# Altium schematic sheet Split_action2026.SchDoc
size A4; SheetNumber: 1; SheetTotal: 1
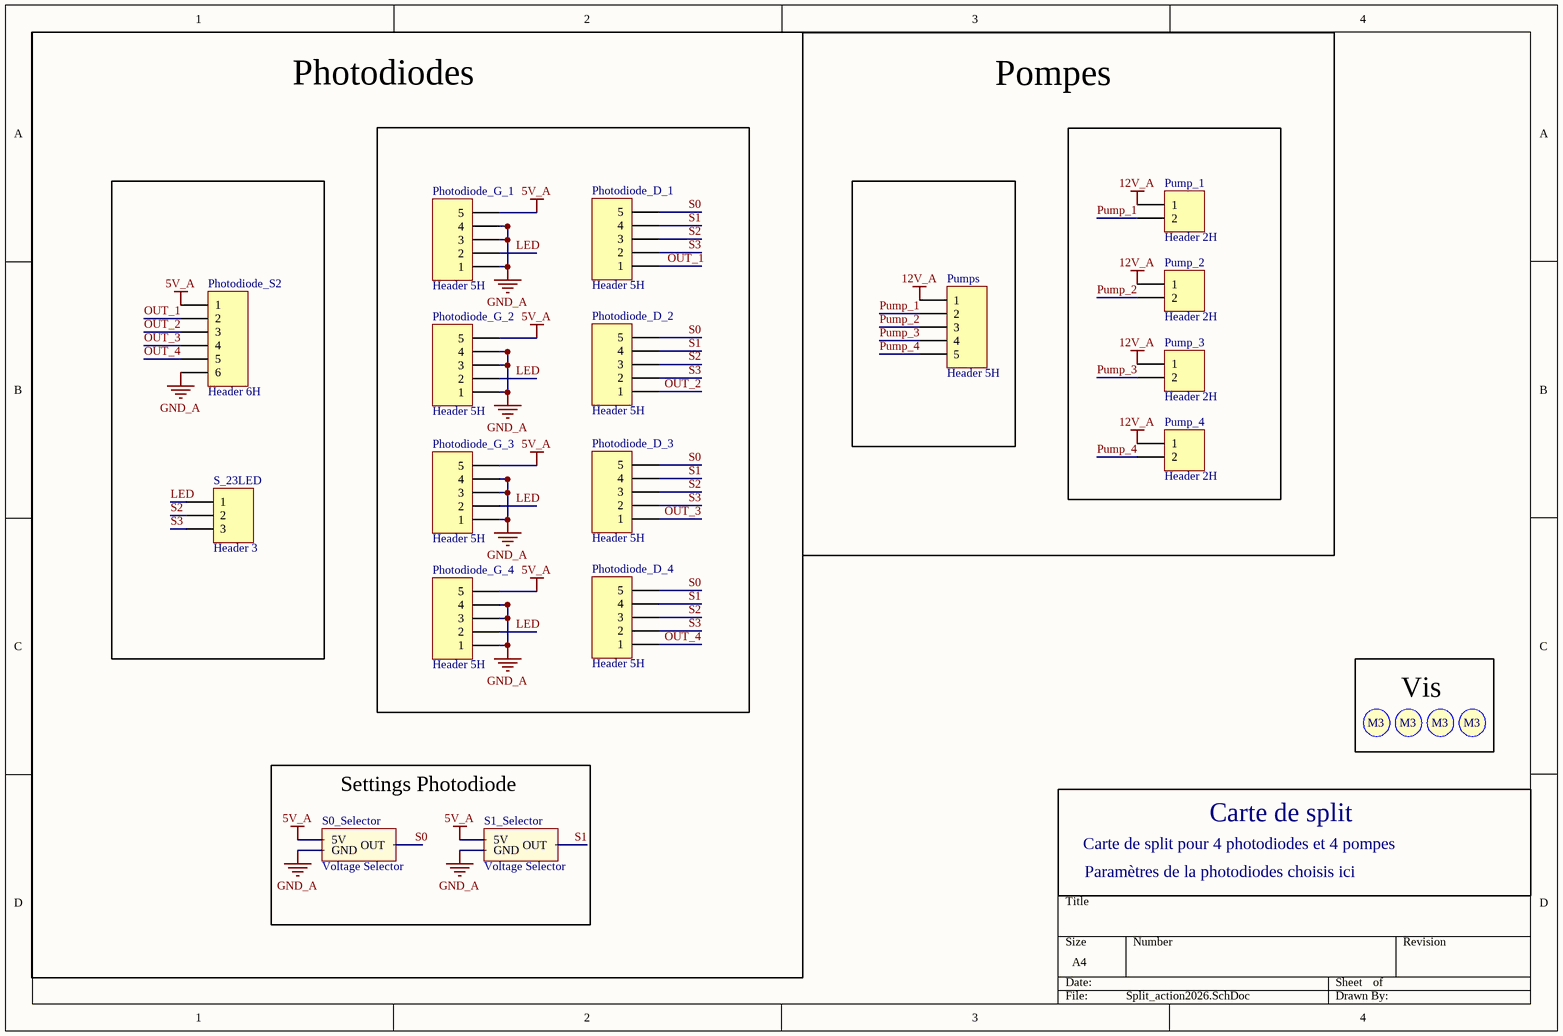
[diagram p0: Split_action2026.SchDoc]

## Parts
Photodiode_D_1  Header 5H  [B5BXHAMLFSN]
Photodiode_D_2  Header 5H  [B5BXHAMLFSN]
Photodiode_D_3  Header 5H  [B5BXHAMLFSN]
Photodiode_D_4  Header 5H  [B5BXHAMLFSN]
Photodiode_G_1  Header 5H  [B5BXHAMLFSN]
Photodiode_G_2  Header 5H  [B5BXHAMLFSN]
Photodiode_G_3  Header 5H  [B5BXHAMLFSN]
Photodiode_G_4  Header 5H  [B5BXHAMLFSN]
Photodiode_S2  Header 6H  [SHDR6W64P0X250_1X6_1740X575X700P]
Pump_1  Header 2H  [JST_B2B-XH-A_(LF)(SN)]
Pump_2  Header 2H  [JST_B2B-XH-A_(LF)(SN)]
Pump_3  Header 2H  [JST_B2B-XH-A_(LF)(SN)]
Pump_4  Header 2H  [JST_B2B-XH-A_(LF)(SN)]
Pumps  Header 5H  [B5BXHAMLFSN]
S0_Selector  Voltage Selector  [VOLTAGE SELECTOR]
S1  Screw M3  [Screw M3]  (value not drawn)
S1_Selector  Voltage Selector  [VOLTAGE SELECTOR]
S2  Screw M3  [Screw M3]  (value not drawn)
S3  Screw M3  [Screw M3]  (value not drawn)
S4  Screw M3  [Screw M3]  (value not drawn)
S_23LED  Header 3  [JST_B3B-XH-A(LF)(SN)]

## Nets
5V_A: Photodiode_G_1.5 Photodiode_G_2.5 Photodiode_G_3.5 Photodiode_G_4.5 Photodiode_S2.1 S0_Selector.1(5V) S1_Selector.1(5V)
12V_A: Pump_1.1 Pump_2.1 Pump_3.1 Pump_4.1 Pumps.1
GND_A: Photodiode_G_1.1 Photodiode_G_1.3 Photodiode_G_1.4 Photodiode_G_2.1 Photodiode_G_2.3 Photodiode_G_2.4 Photodiode_G_3.1 Photodiode_G_3.3 Photodiode_G_3.4 Photodiode_G_4.1 Photodiode_G_4.3 Photodiode_G_4.4 Photodiode_S2.6 S0_Selector.2(GND) S1_Selector.2(GND)
LED: Photodiode_G_1.2 Photodiode_G_2.2 Photodiode_G_3.2 Photodiode_G_4.2 S_23LED.1
OUT_1: Photodiode_D_1.1 Photodiode_S2.2
OUT_2: Photodiode_D_2.1 Photodiode_S2.3
OUT_3: Photodiode_D_3.1 Photodiode_S2.4
OUT_4: Photodiode_D_4.1 Photodiode_S2.5
Pump_1: Pump_1.2 Pumps.2
Pump_2: Pump_2.2 Pumps.3
Pump_3: Pump_3.2 Pumps.4
Pump_4: Pump_4.2 Pumps.5
S0: Photodiode_D_1.5 Photodiode_D_2.5 Photodiode_D_3.5 Photodiode_D_4.5 S0_Selector.3(OUT)
S1: Photodiode_D_1.4 Photodiode_D_2.4 Photodiode_D_3.4 Photodiode_D_4.4 S1_Selector.3(OUT)
S2: Photodiode_D_1.3 Photodiode_D_2.3 Photodiode_D_3.3 Photodiode_D_4.3 S_23LED.2
S3: Photodiode_D_1.2 Photodiode_D_2.2 Photodiode_D_3.2 Photodiode_D_4.2 S_23LED.3

## Notes on the sheet
- Photodiodes
- Pompes
- Extérieur
- (near Pump_1) Extérieur
- Carte Action
- Vis
- Settings Photodiode
- Carte de split pour 4 photodiodes et 4 pompes
- Carte de split
- Paramètres de la photodiodes choisis ici
- (in symbol Screw M3) M3

## Library data of the parts
Photodiode_D_1-Photodiode_D_4 Photodiode_G_1-Photodiode_G_4 Pumps = Header 5H: Header, 5-Pin, Right Angle; LatestRevisionDate: 17-Jul-2002; LatestRevisionNote: Re-released for DXP Platform.; Publisher: Altium Limited
Photodiode_S2 = Header 6H: Header, 6-Pin, Right Angle; LatestRevisionDate: 17-Jul-2002; LatestRevisionNote: Re-released for DXP Platform.; Publisher: Altium Limited
Pump_1-Pump_4 = Header 2H: Header, 2-Pin, Right Angle; LatestRevisionDate: 17-Jul-2002; LatestRevisionNote: Re-released for DXP Platform.; Publisher: Altium Limited
S0_Selector S1_Selector = Voltage Selector: Selection of voltage by soldering pads
S_23LED = Header 3: Header, 3-Pin; LatestRevisionDate: 17-Jul-2002; LatestRevisionNote: Re-released for DXP Platform.; Publisher: Altium Limited